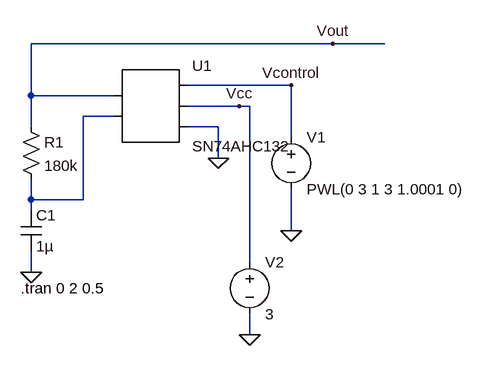
[diagram p0: schematic FES Clock Generation and Control.asc]
FES Clock Generation and Control.asc, the LTspice schematic file:
Version 4
SHEET 1 1236 680
WIRE 512 -80 48 -80
WIRE 592 -80 512 -80
WIRE 448 -16 288 -16
WIRE 48 0 48 -80
WIRE 176 0 48 0
WIRE 368 16 288 16
WIRE 384 16 368 16
WIRE 176 32 128 32
WIRE 48 48 48 0
WIRE 336 48 288 48
WIRE 448 64 448 -16
WIRE 336 96 336 48
WIRE 48 160 48 128
WIRE 128 160 128 32
WIRE 128 160 48 160
WIRE 48 176 48 160
WIRE 448 208 448 144
WIRE 384 256 384 16
WIRE 48 272 48 240
WIRE 384 368 384 336
FLAG 336 96 0
FLAG 48 272 0
FLAG 512 -80 Vout
FLAG 448 208 0
FLAG 384 368 0
FLAG 368 16 Vcc
FLAG 448 -16 Vcontrol
SYMBOL AutoGenerated\\SN74AHC132 224 16 R0
SYMATTR InstName U1
SYMBOL cap 32 176 R0
SYMATTR InstName C1
SYMATTR Value 1µ
SYMBOL res 32 32 R0
SYMATTR InstName R1
SYMATTR Value 180k
SYMBOL voltage 448 48 R0
WINDOW 123 0 0 Left 0
WINDOW 39 0 0 Left 0
SYMATTR InstName V1
SYMATTR Value PWL(0 3 1 3 1.0001 0)
SYMBOL voltage 384 240 R0
WINDOW 123 0 0 Left 0
WINDOW 39 0 0 Left 0
SYMATTR InstName V2
SYMATTR Value 3
TEXT 32 296 Left 2 !.tran 0 2 0.5

The netlist it stands for:
* FES Clock Generation and Control.asc
* U1: SN74AHC132 (symbol AutoGenerated\SN74AHC132 not available, pins judged from their places): pin1=Vout pin2=N001 pin3=Vcontrol pin4=Vcc pin5=0
C1 N001 0 1µ
R1 Vout N001 180k
V1 Vcontrol 0 PWL(0 3 1 3 1.0001 0)
V2 Vcc 0 3
.tran 0 2 0.5
.backanno
.end